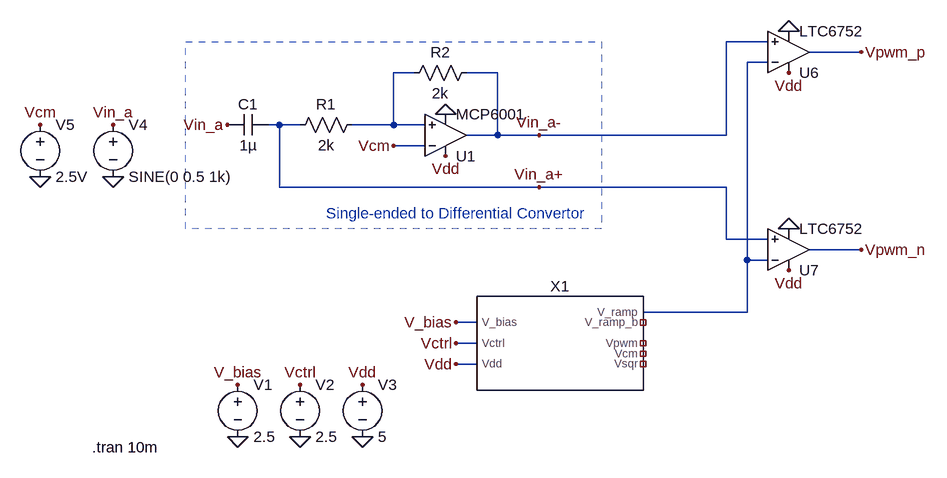
[diagram p0: schematic expt_4_new.asc]
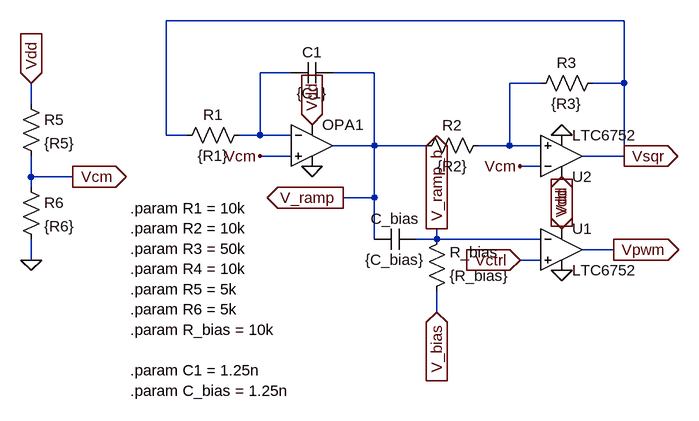
[diagram p1: sub-circuit module_expt1.asc]
expt_4_new.asc, the LTspice schematic file:
Version 4
SHEET 1 1240 680
WIRE 848 16 784 16
WIRE 992 32 912 32
WIRE 848 48 816 48
WIRE 304 64 272 64
WIRE 432 64 384 64
WIRE 96 144 80 144
WIRE 128 144 96 144
WIRE 272 144 272 64
WIRE 272 144 208 144
WIRE 320 144 272 144
WIRE 432 160 432 64
WIRE 432 160 384 160
WIRE 496 160 432 160
WIRE 784 160 784 16
WIRE 784 160 496 160
WIRE 320 176 272 176
WIRE 96 240 96 144
WIRE 496 240 96 240
WIRE 784 240 496 240
WIRE 784 320 784 240
WIRE 848 320 784 320
WIRE 992 336 912 336
WIRE 816 352 816 48
WIRE 848 352 816 352
WIRE 816 432 816 352
WIRE 816 432 656 432
WIRE 400 448 368 448
WIRE 400 480 368 480
WIRE 400 512 368 512
FLAG 272 176 Vcm
FLAG 16 144 Vin_a
FLAG 496 160 Vin_a-
FLAG 496 240 Vin_a+
FLAG 992 32 Vpwm_p
FLAG 992 336 Vpwm_n
FLAG 32 624 0
FLAG 128 624 0
FLAG 224 624 0
FLAG 32 544 V_bias
FLAG 128 544 Vctrl
FLAG 224 544 Vdd
FLAG 368 448 V_bias
FLAG 368 480 Vctrl
FLAG 368 512 Vdd
FLAG -160 224 0
FLAG -160 144 Vin_a
FLAG 880 64 Vdd
FLAG 880 368 Vdd
FLAG 880 304 0
FLAG 880 0 0
FLAG 352 128 0
FLAG 352 192 Vdd
FLAG -272 224 0
FLAG -272 144 Vcm
SYMBOL cap 80 128 R90
WINDOW 0 0 32 VBottom 2
WINDOW 3 32 32 VTop 2
SYMATTR InstName C1
SYMATTR Value 1µ
SYMBOL res 224 128 R90
WINDOW 0 0 56 VBottom 2
WINDOW 3 32 56 VTop 2
SYMATTR InstName R1
SYMATTR Value 2k
SYMBOL res 400 48 R90
WINDOW 0 0 56 VBottom 2
WINDOW 3 32 56 VTop 2
SYMATTR InstName R2
SYMATTR Value 2k
SYMBOL MCP6001 352 160 M180
SYMATTR InstName U1
SYMBOL module_expt1 528 480 R0
SYMATTR InstName X1
SYMBOL voltage 32 528 R0
SYMATTR InstName V1
SYMATTR Value 2.5
SYMBOL voltage 128 528 R0
SYMATTR InstName V2
SYMATTR Value 2.5
SYMBOL voltage 224 528 R0
SYMATTR InstName V3
SYMATTR Value 5
SYMBOL voltage -160 128 R0
WINDOW 123 0 0 Left 0
WINDOW 39 0 0 Left 0
SYMATTR InstName V4
SYMATTR Value SINE(0 0.5 1k)
SYMBOL voltage -272 128 R0
WINDOW 123 0 0 Left 0
WINDOW 39 0 0 Left 0
SYMATTR InstName V5
SYMATTR Value 2.5V
SYMBOL Comparators\\LTC6752 880 96 M180
SYMATTR InstName U6
SYMBOL Comparators\\LTC6752 880 400 M180
SYMATTR InstName U7
TEXT 168 280 Left 2 ;Single-ended to Differential Convertor
TEXT -192 640 Left 2 !.tran 10m
RECTANGLE Normal 592 304 -48 16 2

module_expt1.asc, the sub-circuit schematic file:
Version 4
SHEET 1 880 680
WIRE 528 -32 -176 -32
WIRE 16 48 -32 48
WIRE 144 48 80 48
WIRE 400 64 352 64
WIRE 528 64 528 -32
WIRE 528 64 480 64
WIRE -384 96 -384 64
WIRE -176 144 -176 -32
WIRE -144 144 -176 144
WIRE -32 144 -32 48
WIRE -32 144 -64 144
WIRE 16 144 -32 144
WIRE 144 160 144 48
WIRE 144 160 80 160
WIRE 224 160 144 160
WIRE 352 160 352 64
WIRE 352 160 304 160
WIRE 400 160 352 160
WIRE 16 176 -32 176
WIRE 528 176 528 64
WIRE 528 176 464 176
WIRE 400 192 368 192
WIRE -384 208 -384 176
WIRE -320 208 -384 208
WIRE -384 224 -384 208
WIRE 144 240 144 160
WIRE 144 240 96 240
WIRE 144 304 144 240
WIRE 240 304 240 288
WIRE 240 304 208 304
WIRE 400 304 240 304
WIRE 512 320 464 320
WIRE -384 336 -384 304
WIRE 400 336 368 336
WIRE 240 416 240 384
FLAG -384 336 0
FLAG -320 208 Vcm
IOPIN -320 208 Out
FLAG -384 64 Vdd
IOPIN -384 64 In
FLAG -32 176 Vcm
FLAG 368 336 Vctrl
IOPIN 368 336 In
FLAG 528 176 Vsqr
IOPIN 528 176 Out
FLAG 512 320 Vpwm
IOPIN 512 320 Out
FLAG 368 192 Vcm
FLAG 240 416 V_bias
IOPIN 240 416 In
FLAG 48 128 Vdd
IOPIN 48 128 In
FLAG 432 208 Vdd
IOPIN 432 208 In
FLAG 432 288 Vdd
IOPIN 432 288 In
FLAG 96 240 V_ramp
IOPIN 96 240 Out
FLAG 240 288 V_ramp_b
IOPIN 240 288 Out
FLAG 432 352 0
FLAG 432 144 0
FLAG 48 192 0
SYMBOL res -48 128 R90
WINDOW 0 0 56 VBottom 2
WINDOW 3 32 56 VTop 2
SYMATTR InstName R1
SYMATTR Value {R1}
SYMBOL res 320 144 R90
WINDOW 0 0 56 VBottom 2
WINDOW 3 32 56 VTop 2
SYMATTR InstName R2
SYMATTR Value {R2}
SYMBOL res 224 400 M180
WINDOW 0 36 76 Left 2
WINDOW 3 36 40 Left 2
SYMATTR InstName R_bias
SYMATTR Value {R_bias}
SYMBOL res 384 80 R270
WINDOW 0 32 56 VTop 2
WINDOW 3 0 56 VBottom 2
SYMATTR InstName R3
SYMATTR Value {R3}
SYMBOL cap 80 32 R90
WINDOW 0 0 32 VBottom 2
WINDOW 3 32 32 VTop 2
SYMATTR InstName C1
SYMATTR Value {C1}
SYMBOL cap 208 288 R90
WINDOW 0 0 32 VBottom 2
WINDOW 3 32 32 VTop 2
SYMATTR InstName C_bias
SYMATTR Value {C_bias}
SYMBOL res -400 80 R0
SYMATTR InstName R5
SYMATTR Value {R5}
SYMBOL res -400 208 R0
SYMATTR InstName R6
SYMATTR Value {R6}
SYMBOL OpAmps\\UniversalOpAmp 48 160 R0
SYMATTR InstName OPA1
SYMBOL Comparators\\LTC6752 432 256 R0
SYMATTR InstName U1
SYMBOL Comparators\\LTC6752 432 240 M180
SYMATTR InstName U2
TEXT -232 256 Left 2 !.param R1 = 10k\n.param R2 = 10k\n.param R3 = 50k\n.param R4 = 10k\n.param R5 = 5k\n.param R6 = 5k\n.param R_bias = 10k\n \n.param C1 = 1.25n\n.param C_bias = 1.25n

The netlist it stands for:
* expt_4_new.asc
C1 Vin_a+ Vin_a 1µ
R1 N002 Vin_a+ 2k
R2 Vin_a- N002 2k
* U1: MCP6001 (symbol MCP6001 not available, pins judged from their places): In+=N002 In-=Vcm V+=Vdd V-=0 OUT=Vin_a-
XX1 V_bias Vctrl Vdd N001 NC_01 NC_02 NC_03 NC_04 module_expt1
V1 V_bias 0 2.5
V2 Vctrl 0 2.5
V3 Vdd 0 5
V4 Vin_a 0 SINE(0 0.5 1k)
V5 Vcm 0 2.5V
XU6 Vin_a- N001 Vdd 0 Vpwm_p LTC6752  ; pins In+ In- V+ V- OUT
XU7 Vin_a+ N001 Vdd 0 Vpwm_n LTC6752  ; pins In+ In- V+ V- OUT

* block symbol definitions
.subckt module_expt1 V_bias Vctrl Vdd V_ramp V_ramp_b Vpwm Vsqr Vcm
R1 N001 Vsqr {R1}
R2 N002 V_ramp {R2}
R_bias V_bias V_ramp_b {R_bias}
R3 N002 Vsqr {R3}
C1 V_ramp N001 {C1}
C_bias V_ramp_b V_ramp {C_bias}
R5 Vdd Vcm {R5}
R6 Vcm 0 {R6}
XOPA1 Vcm N001 Vdd 0 V_ramp level1 Avol=1Meg GBW=10Meg Vos=0 En=0 Enk=0 In=0 Ink=0 Rin=500Meg  ; pins In+ In- V+ V- OUT
XU1 Vctrl V_ramp_b Vdd 0 Vpwm LTC6752  ; pins In+ In- V+ V- OUT
XU2 N002 Vcm Vdd 0 Vsqr LTC6752  ; pins In+ In- V+ V- OUT
.param R1 = 10k
.param R2 = 10k
.param R3 = 50k
.param R4 = 10k
.param R5 = 5k
.param R6 = 5k
.param R_bias = 10k
.param C1 = 1.25n
.param C_bias = 1.25n
.ends module_expt1

* Single-ended to Differential Convertor
.tran 10m
.lib UniversalOpAmp1.lib
.lib LTC7.lib
.backanno
.end